# EAGLE design 32-16 adapter2 (EAGLE 7.2.0)
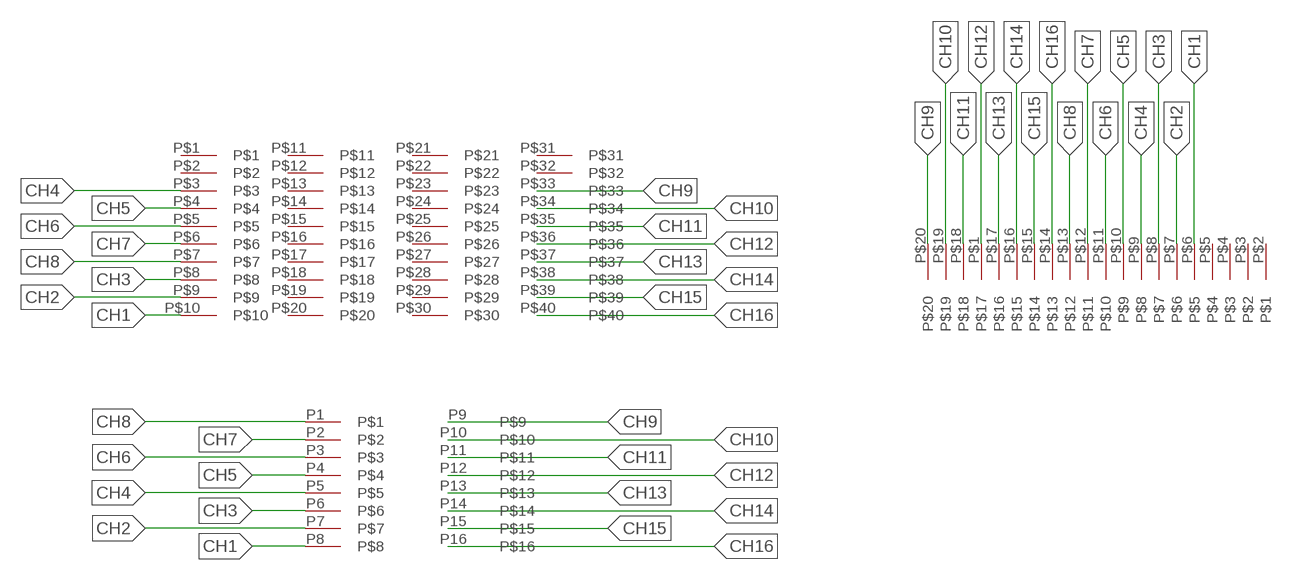
[diagram p0: schematic, sheet 1]

## Parts
U$1  16_PAD  [16_PAD]
U$2  DIL-16CHN  [DIL-16CHN]
U$3  MOLC-SAMTEC-32  [MOLC-SAMTEC-32]

## Nets
CH1: U$1.P$6 U$2.P8 U$3.P$10
CH2: U$1.P$7 U$2.P7 U$3.P$9
CH3: U$1.P$8 U$2.P6 U$3.P$8
CH4: U$1.P$9 U$2.P5 U$3.P$3
CH5: U$1.P$10 U$2.P4 U$3.P$4
CH6: U$1.P$11 U$2.P3 U$3.P$5
CH7: U$1.P$12 U$2.P2 U$3.P$6
CH8: U$1.P$13 U$2.P1 U$3.P$7
CH9: U$1.P$20 U$2.P9 U$3.P$33
CH10: U$1.P$19 U$2.P10 U$3.P$34
CH11: U$1.P$18 U$2.P11 U$3.P$35
CH12: U$1.P$1 U$2.P12 U$3.P$36
CH13: U$1.P$17 U$2.P13 U$3.P$37
CH14: U$1.P$16 U$2.P14 U$3.P$38
CH15: U$1.P$15 U$2.P15 U$3.P$39
CH16: U$1.P$14 U$2.P16 U$3.P$40
Unconnected: U$1.P$2 U$1.P$3 U$1.P$4 U$1.P$5 U$3.P$1 U$3.P$2 U$3.P$11 U$3.P$12 U$3.P$13 U$3.P$14 U$3.P$15 U$3.P$16 U$3.P$17 U$3.P$18 U$3.P$19 U$3.P$20 U$3.P$21 U$3.P$22 U$3.P$23 U$3.P$24 U$3.P$25 U$3.P$26 U$3.P$27 U$3.P$28 U$3.P$29 U$3.P$30 U$3.P$31 U$3.P$32

## Library data of the parts
U$1 = mayo:16_PAD
U$2 = mayo:DIL-16CHN
U$3 = mayo:MOLC-SAMTEC-32

## Board
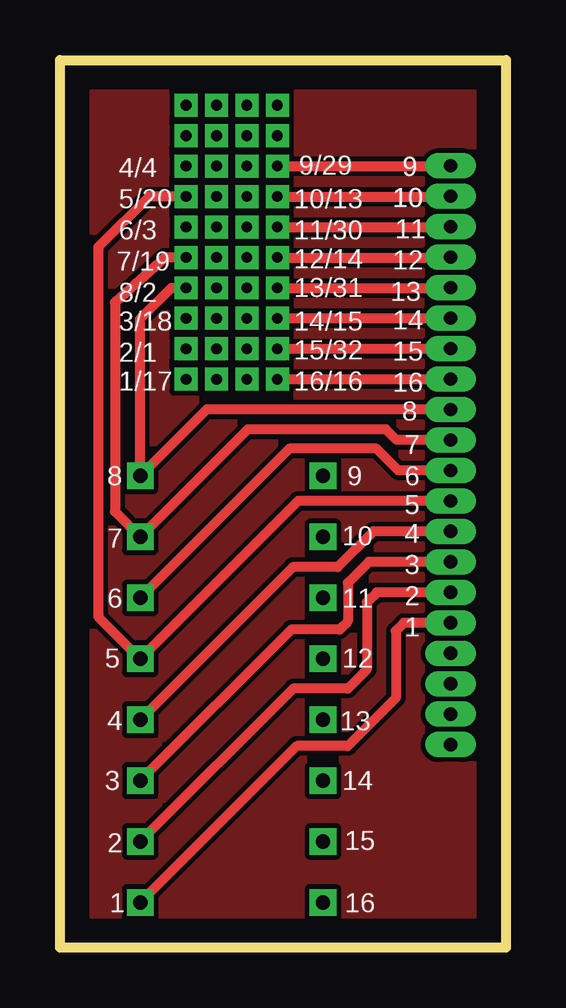
[diagram p1: board, top side]
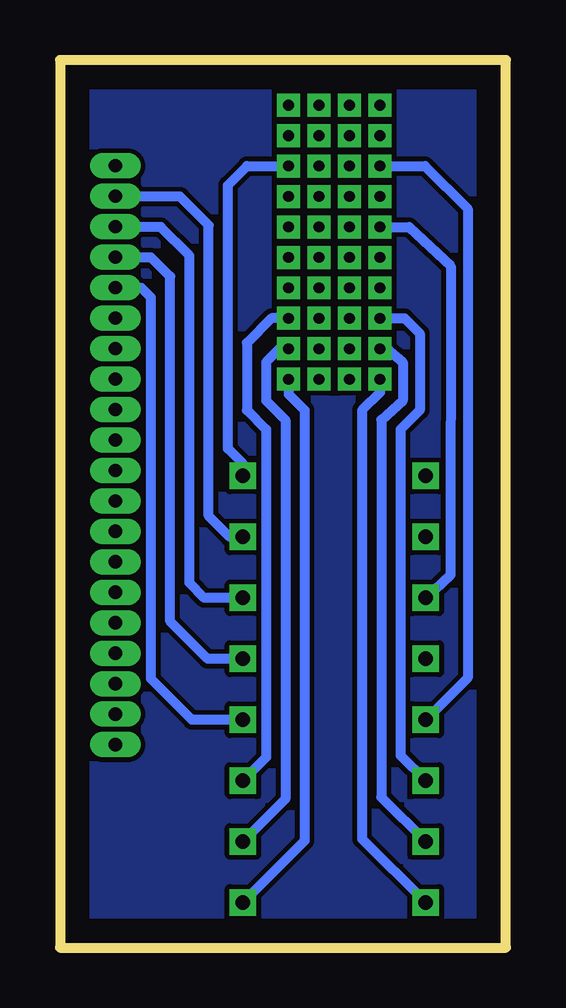
[diagram p2: board, bottom side, seen from below]

Size 18.6 x 37 mm. Coordinates in mm from the lower left corner, seen from the top.
Outline: 0,37 18.6,37 18.6,0 0,0 0,37
Copper layers (1*16): Top 0.035mm / dielectric 1.5mm / Bottom 0.035mm
Design rules "default": minimum track width 10mil, minimum drill 24mil, track to track 8mil, track to pad 8mil, pad to pad 8mil, via to via 8mil, smd to smd 8mil, copper to edge 40mil, drill to drill 8mil, minimum pad ring 10mil, minimum via ring 8mil, stop-mask expansion 4mil, vias tented up to drill 0mil, thermal gap 10mil

### Footprints (pad centres in the part's own frame; a part is rotated, then mirrored left to right if it is on the bottom)
16_PAD = drill 0.55 pad 1.016 long: P$1 6.35,0; P$2 -13.97,0; P$3 -12.7,0; P$4 -11.43,0; P$5 -10.16,0; P$6 -8.89,0; P$7 -7.62,0; P$8 -6.35,0; P$9 -5.08,0; P$10 -3.81,0; P$11 -2.54,0; P$12 -1.27,0; P$13 0,0; P$14 1.27,0; P$15 2.54,0; P$16 3.81,0; P$17 5.08,0; P$18 7.62,0; P$19 8.89,0; P$20 10.16,0
DIL-16CHN = drill 0.6 pad 1.016 square: P1 -10.16,10.16; P2 -10.16,7.62; P3 -10.16,5.08; P4 -10.16,2.54; P5 -10.16,0; P6 -10.16,-2.54; P7 -10.16,-5.08; P8 -10.16,-7.62; P9 -2.54,10.16; P10 -2.54,7.62; P11 -2.54,5.08; P12 -2.54,2.54; P13 -2.54,0; P14 -2.54,-2.54; P15 -2.54,-5.08; P16 -2.54,-7.62
MOLC-SAMTEC-32 = drill 0.45 pad 0.61 square: P$1 0,11.43; P$2 0,10.16; P$3 0,8.89; P$4 0,7.62; P$5 0,6.35; P$6 0,5.08; P$7 0,3.81; P$8 0,2.54; P$9 0,1.27; P$10 0,0; P$11 1.27,11.43; P$12 1.27,10.16; P$13 1.27,8.89; P$14 1.27,7.62; P$15 1.27,6.35; P$16 1.27,5.08; P$17 1.27,3.81; P$18 1.27,2.54; P$19 1.27,1.27; P$20 1.27,0; P$21 2.54,11.43; P$22 2.54,10.16; P$23 2.54,8.89; P$24 2.54,7.62; P$25 2.54,6.35; P$26 2.54,5.08; P$27 2.54,3.81; P$28 2.54,2.54; P$29 2.54,1.27; P$30 2.54,0; P$31 3.81,11.43; P$32 3.81,10.16; P$33 3.81,8.89; P$34 3.81,7.62; P$35 3.81,6.35; P$36 3.81,5.08; P$37 3.81,3.81; P$38 3.81,2.54; P$39 3.81,1.27; P$40 3.81,0

### Placement (x,y rotation side)
U$1  16.29,22.43 90 top
U$2  13.51,9.5 0 top
U$3  5.26,23.69 0 top

### Tracks (layer width: path | path; a pad name or v marks a point on that pad's centre or on a via)
CH1
  Top 0.406: U$1.P$6 14.34,13.54 14,13.2 14,10.4 12,8.4 9.87,8.4 U$2.P8
  Bottom 0.406: U$3.P$10 5.26,23.15 6,22.4 6,4.53 U$2.P8
CH2
  Top 0.406: U$1.P$7 13.21,14.81 12.8,14.4 12.8,11.6 12,10.8 9.73,10.8 U$2.P7
  Bottom 0.406: U$3.P$9 4.96,24.96 4.3,24.4 4.3,22.8 5.2,22 5.2,6.27 U$2.P7
CH3
  Top 0.406: U$1.P$8 12.88,16.08 12,15.2 12,13.6 11.66,13.26 9.65,13.26 U$2.P6
  Bottom 0.406: U$3.P$8 4.23,26.23 3.6,25.6 3.6,22.4 4.4,21.6 4.4,8.01 U$2.P6
CH4
  Top 0.406: U$1.P$9 13.07,17.35 11.58,15.86 9.71,15.86 U$2.P5
  Bottom 0.406: U$3.P$3 3.38,32.58 1.6,30.8 1.6,11.25 U$2.P5
CH5
  Top 0.406: U$1.P$10 9.93,18.62 U$2.P4 1.6,13.79 1.6,29.2 3.71,31.31 U$3.P$4
CH6
  Top 0.406: U$1.P$11 14.11,19.89 13.2,20.8 9.57,20.8 U$2.P3
  Bottom 0.406: U$3.P$5 4.04,30.04 2.3,28.4 2.31,15.54 U$2.P3
CH7
  Top 0.406: U$1.P$12 14.04,21.16 13.6,21.6 7.83,21.6 U$2.P2 2.3,18.17 2.3,26.9 4.37,28.77 U$3.P$6
CH8
  Top 0.406: U$1.P$13 6.12,22.43 U$2.P1 3.33,19.68 3.33,26.19 4.64,27.5 U$3.P$7
CH9
  Top 0.406: U$3.P$33 15.88,32.58 U$1.P$20
  Bottom 0.406: U$2.P9 10.97,20.17 11.6,20.8 11.6,31.78 10.8,32.58 U$3.P$33
CH10
  Top 0.406: U$3.P$34 15.88,31.31 U$1.P$19
  Bottom 0.406: U$2.P10 11.52,17.12 12.4,18 12.4,30.11 13.6,31.31 U$1.P$19
CH11
  Top 0.406: U$3.P$35 15.88,30.04 U$1.P$18
  Bottom 0.406: U$2.P11 12.58,14.58 13.2,15.2 13.2,28.84 14.4,30.04 U$1.P$18
CH12
  Top 0.406: U$3.P$36 15.88,28.77 U$1.P$1
  Bottom 0.406: U$2.P12 12.44,12.04 14,13.6 14,27.97 14.8,28.77 U$1.P$1
CH13
  Top 0.406: U$3.P$37 15.88,27.5 U$1.P$17
  Bottom 0.406: U$2.P13 13.1,9.5 14.8,11.2 14.8,27.1 15.2,27.5 U$1.P$17
CH14
  Top 0.406: U$3.P$38 15.88,26.23 U$1.P$16
  Bottom 0.406: U$3.P$38 9.77,26.23 10.8,25.2 10.8,22.4 10,21.6 10,7.93 U$2.P14
CH15
  Top 0.406: U$3.P$39 15.88,24.96 U$1.P$15
  Bottom 0.406: U$3.P$39 9.44,24.96 10,24.4 10,22.8 9.2,22 9.2,6.19 U$2.P15
CH16
  Top 0.406: U$3.P$40 15.88,23.69 U$1.P$14
  Bottom 0.406: U$3.P$40 9.07,23.06 8.4,22.4 8.4,4.45 U$2.P16
N$1
  pour Bottom: -0.2,37 18.6,37 18.6,-0.4 -0.2,-0.4
N$2
  pour Top: 0,37 18.6,37 18.6,0 0,0

### Text on the board
tPlace: 4/4 | 9/29 | 9 | 9 | 5/20 | 10/13 | 10 | 10 | 6/3 | 11/30 | 11 | 7/19 | 12/14 | 12 | 13 | 8/2 | 13/31 | 3/18 | 14/15 | 14 | 15/32 | 2/1 | 15 | 1/17 | 16/16 | 16 | 8 | 7 | 8 | 9 | 6 | 5 | 7 | 10 | 4 | 3 | 6 | 11 | 2 | 1 | 5 | 12 | 13 | 4 | 3 | 14 | 2 | 15 | 1 | 16